# Altium schematic sheet Sensors.SchDoc
size A3; Organization: ETML-ES; Address1: Avenue Recordon 1; Address2: 1004 Lausanne; Address3: Switzerland; SheetNumber: 5; SheetTotal: 6
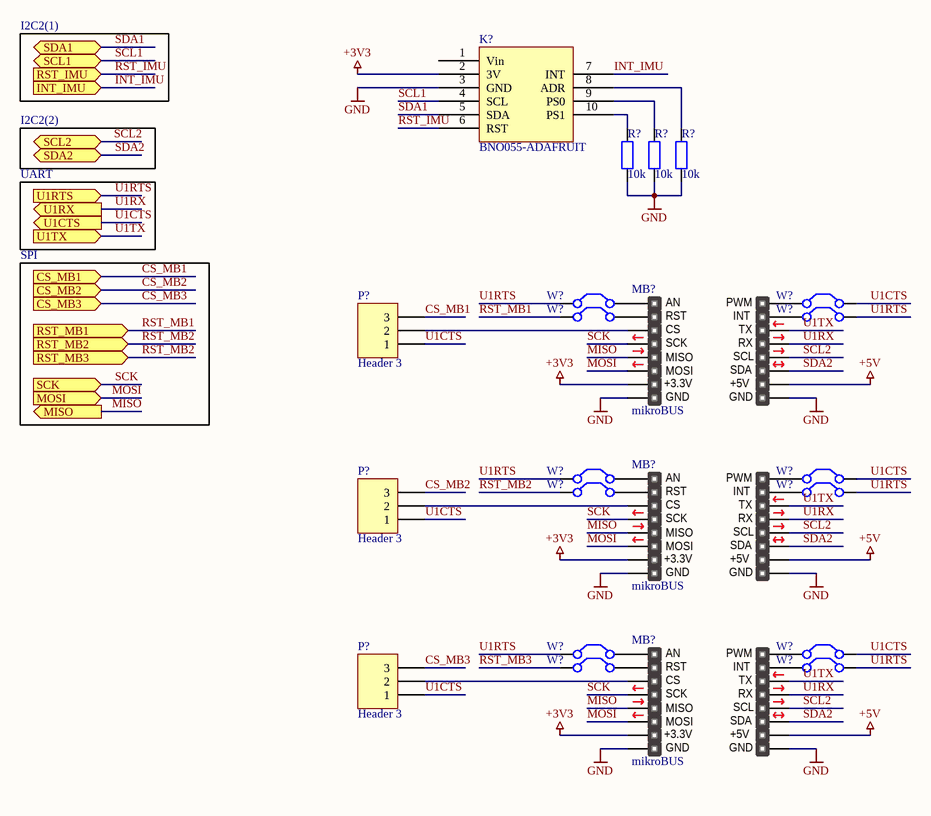
[diagram p0: Sensors.SchDoc]

## Parts
(Parts that share a designator on the sheet are numbered #1, #2 ... from top to bottom, then left to right.)
K?  BNO055-ADAFRUIT
MB?#1  mikroBUS  [mikroBUS - Large]  (no BOM)
MB?#2  mikroBUS  [mikroBUS - Large]  (no BOM)
MB?#3  mikroBUS  [mikroBUS - Large]  (no BOM)
P?#1  Header 3  [HDR1X3]
P?#2  Header 3  [HDR1X3]
P?#3  Header 3  [HDR1X3]
R?#1  value 10k  [AXIAL-0.4]  (hidden comment: Res2)
R?#2  value 10k  [AXIAL-0.4]  (hidden comment: Res2)
R?#3  value 10k  [AXIAL-0.4]  (hidden comment: Res2)
W?#1  Jumper  [RAD-0.2]  (value not drawn)
W?#2  Jumper  [RAD-0.2]  (value not drawn)
W?#3  Jumper  [RAD-0.2]  (value not drawn)
W?#4  Jumper  [RAD-0.2]  (value not drawn)
W?#5  Jumper  [RAD-0.2]  (value not drawn)
W?#6  Jumper  [RAD-0.2]  (value not drawn)
W?#7  Jumper  [RAD-0.2]  (value not drawn)
W?#8  Jumper  [RAD-0.2]  (value not drawn)
W?#9  Jumper  [RAD-0.2]  (value not drawn)
W?#10  Jumper  [RAD-0.2]  (value not drawn)
W?#11  Jumper  [RAD-0.2]  (value not drawn)
W?#12  Jumper  [RAD-0.2]  (value not drawn)

## Ports
CS_MB1 (in), CS_MB2 (in), CS_MB3 (in), INT_IMU (in), MISO (out), MOSI (in), RST_IMU (in), RST_MB1 (in), RST_MB2 (in), RST_MB3 (in), SCK (in), SCL1 (bidir), SCL2 (bidir), SDA1 (bidir), SDA2 (bidir), U1CTS (out), U1RTS (in), U1RX (out), U1TX (in)

## Nets
+3V3: K?.2(3V) MB?#1.7(3.3V) MB?#2.7(3.3V) MB?#3.7(3.3V)
+5V: MB?#1.10(5V) MB?#2.10(5V) MB?#3.10(5V)
GND: K?.3(GND) MB?#1.8(GND) MB?#1.9(GND) MB?#2.8(GND) MB?#2.9(GND) MB?#3.8(GND) MB?#3.9(GND) R?#1.1 R?#2.1 R?#3.1
CS_MB1: P?#1.3 ; port CS_MB1
CS_MB2: P?#2.3 ; port CS_MB2
CS_MB3: P?#3.3 ; port CS_MB3
INT_IMU: K?.7(INT) ; port INT_IMU
MISO: MB?#1.5(MISO) MB?#2.5(MISO) MB?#3.5(MISO) ; port MISO
MOSI: MB?#1.6(MOSI) MB?#2.6(MOSI) MB?#3.6(MOSI) ; port MOSI
RST_IMU: K?.6(RST) ; port RST_IMU
RST_MB1: W?#3.1(C1) ; port RST_MB1
RST_MB2: W?#7.1(C1) ; port RST_MB2, port RST_MB3
RST_MB3: W?#11.1(C1)
SCK: MB?#1.4(SCK) MB?#2.4(SCK) MB?#3.4(SCK) ; port SCK
SCL1: K?.4(SCL) ; port SCL1
SCL2: MB?#1.12(SCL) MB?#2.12(SCL) MB?#3.12(SCL) ; port SCL2
SDA1: K?.5(SDA) ; port SDA1
SDA2: MB?#1.11(SDA) MB?#2.11(SDA) MB?#3.11(SDA) ; port SDA2
U1CTS: P?#1.1 P?#2.1 P?#3.1 W?#2.2(C2) W?#6.2(C2) W?#10.2(C2) ; port U1CTS
U1RTS: W?#1.1(C1) W?#4.2(C2) W?#5.1(C1) W?#8.2(C2) W?#9.1(C1) W?#12.2(C2) ; port U1RTS
U1RX: MB?#1.13(TX) MB?#2.13(TX) MB?#3.13(TX) ; port U1RX
U1TX: MB?#1.14(RX) MB?#2.14(RX) MB?#3.14(RX) ; port U1TX
NetK?_8: K?.8(ADR) R?#3.2
NetK?_9: K?.9(PS0) R?#2.2
NetK?_10: K?.10(PS1) R?#1.2
NetMB?#1_1: MB?#1.1(AN) W?#1.2(C2)
NetMB?#1_2: MB?#1.2(RST) W?#3.2(C2)
NetMB?#1_3: MB?#1.3(CS) P?#1.2
NetMB?#1_15: MB?#1.15(INT) W?#4.1(C1)
NetMB?#1_16: MB?#1.16(PWM) W?#2.1(C1)
NetMB?#2_1: MB?#2.1(AN) W?#5.2(C2)
NetMB?#2_2: MB?#2.2(RST) W?#7.2(C2)
NetMB?#2_3: MB?#2.3(CS) P?#2.2
NetMB?#2_15: MB?#2.15(INT) W?#8.1(C1)
NetMB?#2_16: MB?#2.16(PWM) W?#6.1(C1)
NetMB?#3_1: MB?#3.1(AN) W?#9.2(C2)
NetMB?#3_2: MB?#3.2(RST) W?#11.2(C2)
NetMB?#3_3: MB?#3.3(CS) P?#3.2
NetMB?#3_15: MB?#3.15(INT) W?#12.1(C1)
NetMB?#3_16: MB?#3.16(PWM) W?#10.1(C1)

Not connected (* = marked no-connect by the designer): K? 1(Vin)

## Notes on the sheet
- I2C2(1)
- I2C2(2)
- UART
- SPI
- Fichier :
- a
- Date :
- Heure :
- Version :
- Auteur :
- Modif.
- b
- c
- d
- Projet :
- No :
- Nb feuilles
- Feuille n°
- Chemin :
- (in symbol mikroBUS compatible add-on board) +3.3V; +5V

## Library data of the parts
MB?#1-MB?#3 = mikroBUS compatible add-on board
P?#1-P?#3 = Header 3: Header, 3-Pin; LatestRevisionDate: 17-Jul-2002; LatestRevisionNote: Re-released for DXP Platform.; Publisher: Altium Limited
R?#1-R?#3 = Res2: Resistor; Published: 8-Jun-2000; LatestRevisionDate: 17-Jul-2002; LatestRevisionNote: Re-released for DXP Platform.; PackageReference: AXIAL-0.4; Publisher: Altium Limited; PackageDescription: Axial Device, Thru-Hole; 2 Leads; 0.4 in Pin Spacing
W?#1-W?#12 = Jumper: Jumper Wire; Published: 24-Mar-1999; LatestRevisionDate: 17-Jul-2002; LatestRevisionNote: Re-released for DXP Platform.; PackageReference: RAD-0.2; Publisher: Altium Limited; PackageDescription: Radial Cap, Thru-Hole; 2 Leads; 0.2 in Pin Spacing